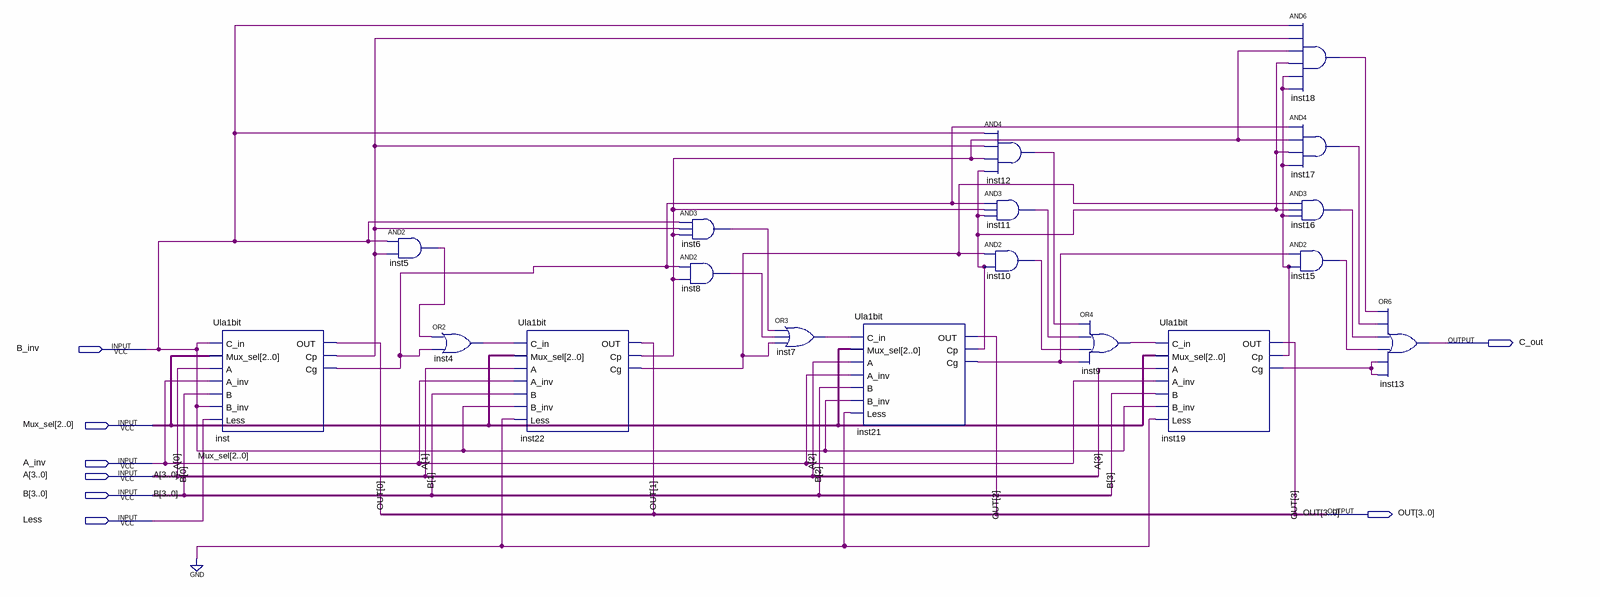
[diagram p0: schematic sheet]
// Quartus schematic Ula4bitsLSB.bdf as structural Verilog: 18 symbols, 8 pins
module Ula4bitsLSB (
  input  B_inv,
  input  [2:0] Mux_sel,
  input  A_inv,
  input  [3:0] A,
  input  [3:0] B,
  input  Less,
  output C_out,
  output [3:0] OUT
);

  wire inst4_out, inst5_out, inst6_out, inst7_out, inst8_out, inst9_out, inst10_out, inst11_out, inst12_out,
       inst15_out, inst16_out, inst17_out, inst18_out, inst19_cg, inst19_cp, inst21_cg, inst21_cp, inst22_cg,
       inst22_cp, inst_cg, inst_cp;

  Ula1bit inst (
    .C_in(B_inv), .Mux_sel(Mux_sel), .A(A[0]), .A_inv(A_inv), .B(B[0]), .B_inv(B_inv), .Less(Less),
    .OUT(OUT[0]), .Cp(inst_cp), .Cg(inst_cg));
  and inst5 (inst5_out, B_inv, inst_cp);
  or inst4 (inst4_out, inst5_out, inst_cg);
  Ula1bit inst22 (
    .C_in(inst4_out), .Mux_sel(Mux_sel), .A(A[1]), .A_inv(A_inv), .B(B[1]), .B_inv(B_inv), .Less(1'b0),
    .OUT(OUT[1]), .Cp(inst22_cp), .Cg(inst22_cg));
  and inst6 (inst6_out, B_inv, inst_cp, inst22_cp);
  and inst8 (inst8_out, inst_cg, inst22_cp);
  or inst7 (inst7_out, inst6_out, inst8_out, inst22_cg);
  Ula1bit inst21 (
    .C_in(inst7_out), .Mux_sel(Mux_sel), .A(A[2]), .A_inv(A_inv), .B(B[2]), .B_inv(B_inv), .Less(1'b0),
    .OUT(OUT[2]), .Cp(inst21_cp), .Cg(inst21_cg));
  and inst12 (inst12_out, B_inv, inst_cp, inst22_cp, inst21_cp);
  and inst11 (inst11_out, inst_cg, inst22_cp, inst21_cp);
  and inst10 (inst10_out, inst22_cg, inst21_cp);
  or inst9 (inst9_out, inst12_out, inst11_out, inst10_out, inst21_cg);
  Ula1bit inst19 (
    .C_in(inst9_out), .Mux_sel(Mux_sel), .A(A[3]), .A_inv(A_inv), .B(B[3]), .B_inv(B_inv), .Less(1'b0),
    .OUT(OUT[3]), .Cp(inst19_cp), .Cg(inst19_cg));
  and inst18 (inst18_out, B_inv, inst_cp, inst22_cp, inst21_cp, inst19_cp, inst19_cp);
  and inst17 (inst17_out, inst_cg, inst22_cp, inst21_cp, inst19_cp);
  and inst16 (inst16_out, inst22_cg, inst21_cp, inst19_cp);
  and inst15 (inst15_out, inst21_cg, inst19_cp);
  or inst13 (C_out, inst18_out, inst17_out, inst16_out, inst15_out, inst19_cg, inst19_cg);
endmodule
